# Altium schematic sheet Top_Level.SchDoc
size A4; SheetNumber: 1; SheetTotal: 9
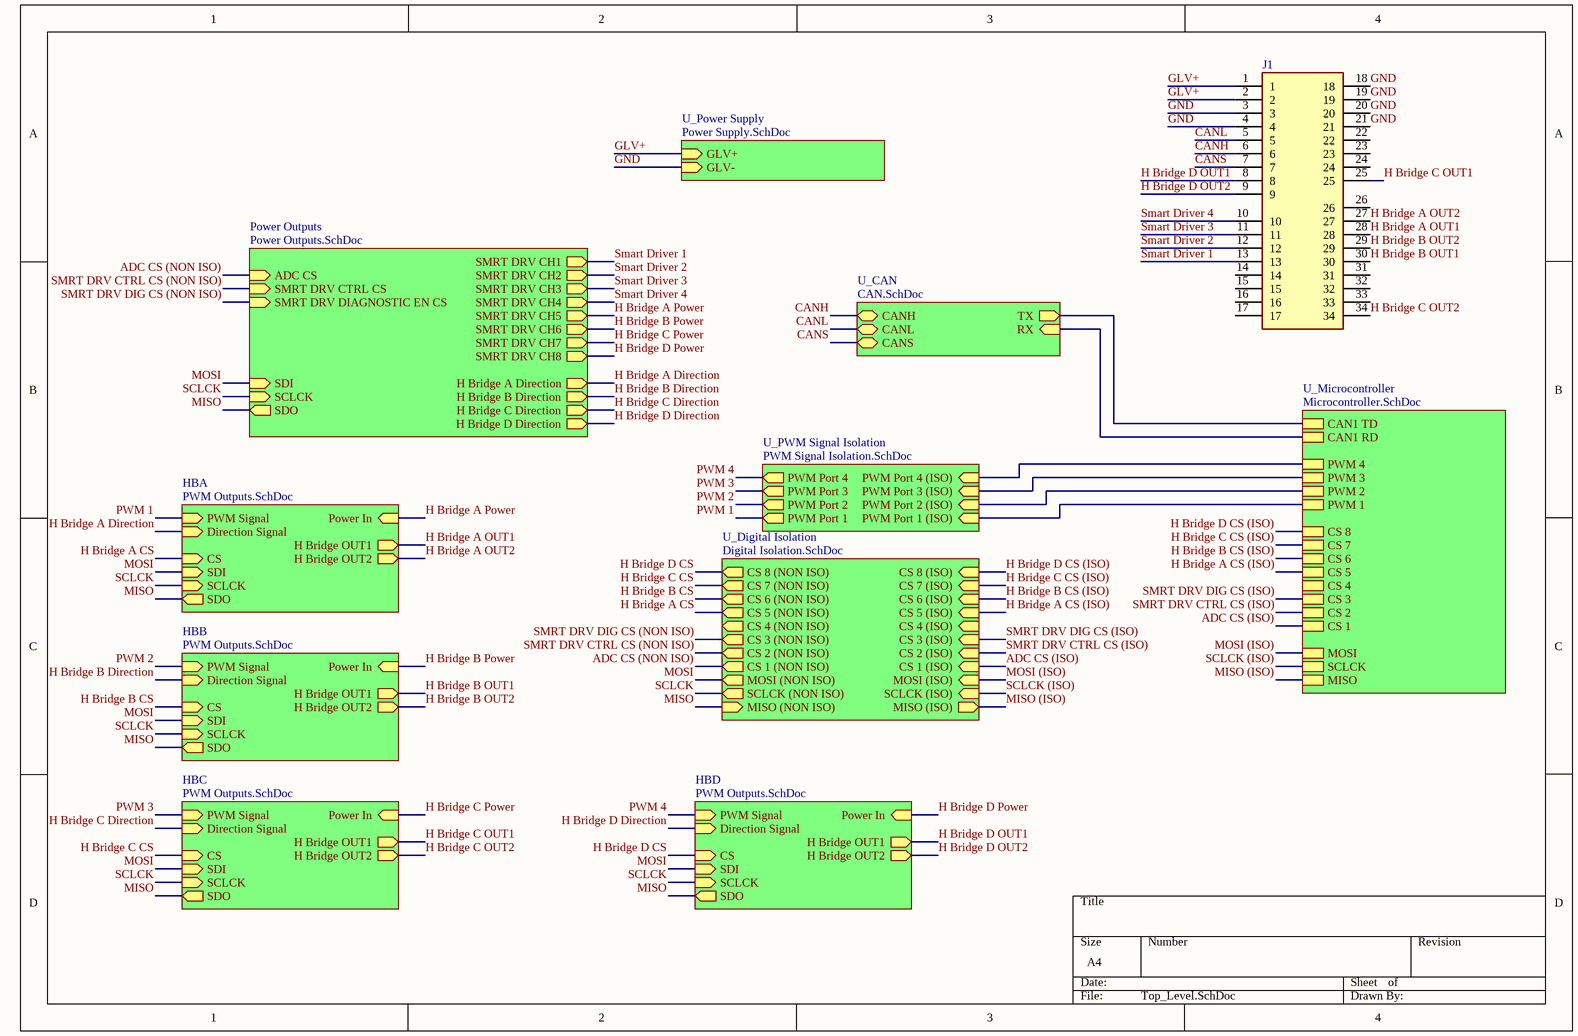
[diagram p0: Top_Level.SchDoc]

## Parts
J1  (no value)  [6437288-1]

## Sub-sheets
HBA = PWM Outputs.SchDoc: PWM Signal (in), Direction Signal (in), H Bridge OUT1 (out), H Bridge OUT2 (out), SDO (out), SCLCK (in), SDI (in), CS (in), Power In (in)
HBB = PWM Outputs.SchDoc: PWM Signal (in), Direction Signal (in), H Bridge OUT1 (out), H Bridge OUT2 (out), SDO (out), SCLCK (in), SDI (in), CS (in), Power In (in)
HBC = PWM Outputs.SchDoc: PWM Signal (in), Direction Signal (in), H Bridge OUT1 (out), H Bridge OUT2 (out), SDO (out), SCLCK (in), SDI (in), CS (in), Power In (in)
HBD = PWM Outputs.SchDoc: PWM Signal (in), Direction Signal (in), H Bridge OUT1 (out), H Bridge OUT2 (out), SDO (out), SCLCK (in), SDI (in), CS (in), Power In (in)
Power Outputs = Power Outputs.SchDoc: SMRT DRV CH1 (out), SMRT DRV CH2 (out), SMRT DRV CH3 (out), SMRT DRV CH4 (out), ADC CS (in), SMRT DRV CTRL CS (in), SDO (out), SCLCK (in), SMRT DRV DIAGNOSTIC EN CS (in), SDI (in), SMRT DRV CH5 (out), SMRT DRV CH6 (out), SMRT DRV CH7 (out), SMRT DRV CH8 (out), H Bridge A Direction (out), H Bridge B Direction (out), H Bridge C Direction (out), H Bridge D Direction (out)
U_CAN = CAN.SchDoc: CANH (bidir), CANL (bidir), CANS (bidir), RX (in), TX (out)
U_Digital Isolation = Digital Isolation.SchDoc: MISO (NON ISO) (in), MOSI (NON ISO) (out), SCLCK (NON ISO) (out), MOSI (ISO) (in), SCLCK (ISO) (in), MISO (ISO) (out), CS 1 (NON ISO) (out), CS 2 (NON ISO) (out), CS 3 (NON ISO) (out), CS 4 (NON ISO) (out), CS 1 (ISO) (in), CS 2 (ISO) (in), CS 3 (ISO) (in), CS 4 (ISO) (in), CS 5 (NON ISO) (out), CS 6 (NON ISO) (out), CS 7 (NON ISO) (out), CS 8 (NON ISO) (out), CS 5 (ISO) (in), CS 6 (ISO) (in), CS 7 (ISO) (in), CS 8 (ISO) (in)
U_Microcontroller = Microcontroller.SchDoc: CAN1 RD, CAN1 TD, PWM 1, PWM 2, PWM 3, PWM 4, SCLCK, MISO, MOSI, CS 1, CS 2, CS 3, CS 4, CS 5, CS 6, CS 7, CS 8
U_Power Supply = Power Supply.SchDoc: GLV+ (in), GLV- (in)
U_PWM Signal Isolation = PWM Signal Isolation.SchDoc: PWM Port 1 (ISO) (in), PWM Port 2 (ISO) (in), PWM Port 3 (ISO) (in), PWM Port 4 (ISO) (in), PWM Port 1 (out), PWM Port 2 (out), PWM Port 3 (out), PWM Port 4 (out)

## Nets
ADC CS (ISO): sheet U_Digital Isolation/CS 1 (ISO), sheet U_Microcontroller/CS 1
ADC CS (NON ISO): sheet Power Outputs/ADC CS, sheet U_Digital Isolation/CS 1 (NON ISO)
CANH: J1.6 ; sheet U_CAN/CANH
CANL: J1.5 ; sheet U_CAN/CANL
CANS: J1.7 ; sheet U_CAN/CANS
GLV+: J1.1 J1.2 ; sheet U_Power Supply/GLV+
GND: J1.3 J1.4 J1.18 J1.19 J1.20 J1.21 ; sheet U_Power Supply/GLV-
H Bridge A CS: sheet U_Digital Isolation/CS 5 (NON ISO), sheet HBA/CS
H Bridge A CS (ISO): sheet U_Digital Isolation/CS 5 (ISO), sheet U_Microcontroller/CS 5
H Bridge A Direction: sheet Power Outputs/H Bridge A Direction, sheet HBA/Direction Signal
H Bridge A OUT1: J1.28 ; sheet HBA/H Bridge OUT1
H Bridge A OUT2: J1.27 ; sheet HBA/H Bridge OUT2
H Bridge A Power: sheet Power Outputs/SMRT DRV CH5, sheet HBA/Power In
H Bridge B CS: sheet U_Digital Isolation/CS 6 (NON ISO), sheet HBB/CS
H Bridge B CS (ISO): sheet U_Digital Isolation/CS 6 (ISO), sheet U_Microcontroller/CS 6
H Bridge B Direction: sheet Power Outputs/H Bridge B Direction, sheet HBB/Direction Signal
H Bridge B OUT1: J1.30 ; sheet HBB/H Bridge OUT1
H Bridge B OUT2: J1.29 ; sheet HBB/H Bridge OUT2
H Bridge B Power: sheet Power Outputs/SMRT DRV CH6, sheet HBB/Power In
H Bridge C CS: sheet U_Digital Isolation/CS 7 (NON ISO), sheet HBC/CS
H Bridge C CS (ISO): sheet U_Digital Isolation/CS 7 (ISO), sheet U_Microcontroller/CS 7
H Bridge C Direction: sheet Power Outputs/H Bridge C Direction, sheet HBC/Direction Signal
H Bridge C OUT1: J1.25 ; sheet HBC/H Bridge OUT1
H Bridge C OUT2: J1.34 ; sheet HBC/H Bridge OUT2
H Bridge C Power: sheet Power Outputs/SMRT DRV CH7, sheet HBC/Power In
H Bridge D CS: sheet U_Digital Isolation/CS 8 (NON ISO), sheet HBD/CS
H Bridge D CS (ISO): sheet U_Digital Isolation/CS 8 (ISO), sheet U_Microcontroller/CS 8
H Bridge D Direction: sheet Power Outputs/H Bridge D Direction, sheet HBD/Direction Signal
H Bridge D OUT1: J1.8 ; sheet HBD/H Bridge OUT1
H Bridge D OUT2: J1.9 ; sheet HBD/H Bridge OUT2
H Bridge D Power: sheet Power Outputs/SMRT DRV CH8, sheet HBD/Power In
MISO: sheet Power Outputs/SDO, sheet U_Digital Isolation/MISO (NON ISO), sheet HBA/SDO, sheet HBB/SDO, sheet HBC/SDO, sheet HBD/SDO
MISO (ISO): sheet U_Digital Isolation/MISO (ISO), sheet U_Microcontroller/MISO
MOSI: sheet Power Outputs/SDI, sheet U_Digital Isolation/MOSI (NON ISO), sheet HBA/SDI, sheet HBB/SDI, sheet HBC/SDI, sheet HBD/SDI
MOSI (ISO): sheet U_Digital Isolation/MOSI (ISO), sheet U_Microcontroller/MOSI
PWM 1: sheet U_PWM Signal Isolation/PWM Port 1, sheet HBA/PWM Signal
PWM 2: sheet U_PWM Signal Isolation/PWM Port 2, sheet HBB/PWM Signal
PWM 3: sheet U_PWM Signal Isolation/PWM Port 3, sheet HBC/PWM Signal
PWM 4: sheet U_PWM Signal Isolation/PWM Port 4, sheet HBD/PWM Signal
SCLCK: sheet Power Outputs/SCLCK, sheet U_Digital Isolation/SCLCK (NON ISO), sheet HBA/SCLCK, sheet HBB/SCLCK, sheet HBC/SCLCK, sheet HBD/SCLCK
SCLCK (ISO): sheet U_Digital Isolation/SCLCK (ISO), sheet U_Microcontroller/SCLCK
Smart Driver 1: J1.13 ; sheet Power Outputs/SMRT DRV CH1
Smart Driver 2: J1.12 ; sheet Power Outputs/SMRT DRV CH2
Smart Driver 3: J1.11 ; sheet Power Outputs/SMRT DRV CH3
Smart Driver 4: J1.10 ; sheet Power Outputs/SMRT DRV CH4
SMRT DRV CTRL CS (ISO): sheet U_Digital Isolation/CS 2 (ISO), sheet U_Microcontroller/CS 2
SMRT DRV CTRL CS (NON ISO): sheet Power Outputs/SMRT DRV CTRL CS, sheet U_Digital Isolation/CS 2 (NON ISO)
SMRT DRV DIG CS (ISO): sheet U_Digital Isolation/CS 3 (ISO), sheet U_Microcontroller/CS 3
SMRT DRV DIG CS (NON ISO): sheet Power Outputs/SMRT DRV DIAGNOSTIC EN CS, sheet U_Digital Isolation/CS 3 (NON ISO)
(unnamed): sheet U_CAN/RX, sheet U_Microcontroller/CAN1 RD
(unnamed): sheet U_CAN/TX, sheet U_Microcontroller/CAN1 TD
(unnamed): sheet U_PWM Signal Isolation/PWM Port 1 (ISO), sheet U_Microcontroller/PWM 1
(unnamed): sheet U_PWM Signal Isolation/PWM Port 2 (ISO), sheet U_Microcontroller/PWM 2
(unnamed): sheet U_PWM Signal Isolation/PWM Port 3 (ISO), sheet U_Microcontroller/PWM 3
(unnamed): sheet U_PWM Signal Isolation/PWM Port 4 (ISO), sheet U_Microcontroller/PWM 4

Not connected (* = marked no-connect by the designer): J1 14 15 16 17 22 23 24 26 31 32 33

## Library data of the parts
J1 = 6437288-1: 34 Position 4 Row Right Angle Receptacle Through Hole Super Seal Cap Assy; MF: TE Connectivity; Positions: 34; Pitch: 3.0 mm; Angle: 90; Contact: Gold; Price: None; MP: 6437288-1; SnapEDA_Link: https://www.snapeda.com/parts/6437288-1/TE%20Connectivity%20AMP%20Connectors/view-part/1468495/?ref=snap; Package: None; Availability: Unavailable; Value: *; Part Number: 6437288-1; Digikey Part Number: A124384-ND; Digikey Link: https://www.digikey.com.au/en/products/detail/te-connectivity-amp-connectors/6437288-1/5428601?s=N4IgTCBcDaIGwBYDMB2MAOdBaAjCAugL5A